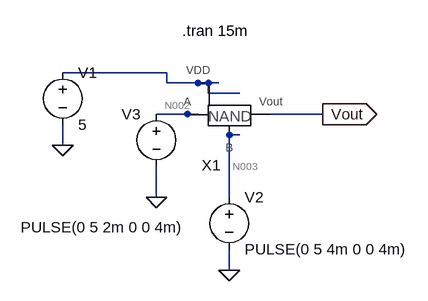
[diagram p0: schematic Simulating_NAND.asc]
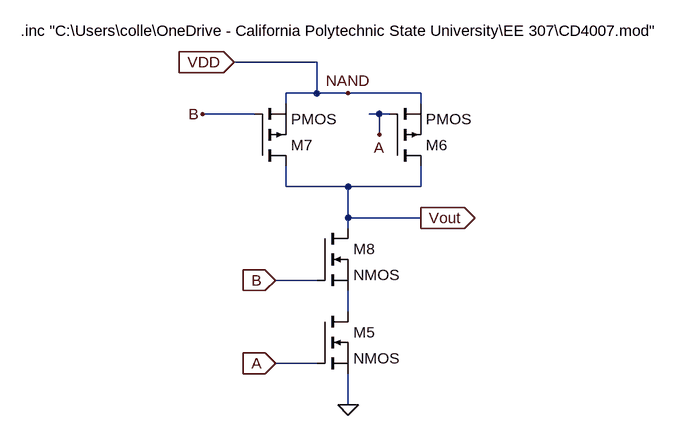
[diagram p1: sub-circuit nand_gate.asc]
Simulating_NAND.asc, the LTspice schematic file:
Version 4
SHEET 1 880 680
WIRE 80 144 -80 144
WIRE 80 160 80 144
WIRE 144 160 80 160
WIRE 160 160 144 160
WIRE 144 176 144 160
WIRE 192 176 144 176
WIRE 128 208 64 208
WIRE 256 208 240 208
WIRE 320 208 256 208
WIRE 192 240 176 240
WIRE -80 256 -80 224
WIRE 64 336 64 288
WIRE 176 336 176 240
WIRE 176 448 176 416
FLAG -80 256 0
FLAG 64 336 0
FLAG 176 448 0
FLAG 320 208 Vout
IOPIN 320 208 Out
SYMBOL Nand_gate 224 224 R0
SYMATTR InstName X1
SYMBOL voltage -80 128 R0
WINDOW 123 0 0 Left 2
WINDOW 39 0 0 Left 2
SYMATTR InstName V1
SYMATTR Value 5
SYMBOL voltage 176 320 R0
WINDOW 123 0 0 Left 2
WINDOW 39 0 0 Left 2
SYMATTR InstName V2
SYMATTR Value PULSE(0 5 4m 0 0 4m)
SYMBOL voltage 64 192 M0
WINDOW 3 -41 190 Left 2
WINDOW 123 0 0 Left 2
WINDOW 39 0 0 Left 2
SYMATTR Value PULSE(0 5 2m 0 0 4m)
SYMATTR InstName V3
TEXT 104 80 Left 2 !.tran 15m

nand_gate.asc, the sub-circuit schematic file:
Version 4
SHEET 1 880 680
WIRE -224 -192 -352 -192
WIRE -224 -144 -224 -192
WIRE -224 -144 -272 -144
WIRE -176 -144 -224 -144
WIRE -64 -144 -176 -144
WIRE -272 -128 -272 -144
WIRE -64 -128 -64 -144
WIRE -320 -112 -400 -112
WIRE -128 -112 -144 -112
WIRE -112 -112 -128 -112
WIRE -128 -80 -128 -112
WIRE -272 0 -272 -32
WIRE -176 0 -272 0
WIRE -64 0 -64 -32
WIRE -64 0 -176 0
WIRE -176 48 -176 0
WIRE -64 48 -176 48
WIRE -176 64 -176 48
WIRE -224 144 -288 144
WIRE -176 192 -176 160
WIRE -224 272 -288 272
WIRE -176 336 -176 288
FLAG -176 -144 NAND
FLAG -176 336 0
FLAG -288 272 A
IOPIN -288 272 In
FLAG -128 -80 A
FLAG -400 -112 B
FLAG -288 144 B
IOPIN -288 144 In
FLAG -64 48 Vout
IOPIN -64 48 Out
FLAG -352 -192 VDD
IOPIN -352 -192 In
SYMBOL nmos -224 192 R0
SYMATTR InstName M5
SYMBOL pmos -112 -32 M180
SYMATTR InstName M6
SYMBOL pmos -320 -32 M180
SYMATTR InstName M7
SYMBOL nmos -224 64 R0
SYMATTR InstName M8
TEXT -680 -240 Left 2 !.inc "C:\\Users\\colle\\OneDrive - California Polytechnic State University\\EE 307\\CD4007.mod"

The netlist it stands for:
* Simulating_NAND.asc
XX1 N002 N003 Vout N001 nand_gate
V1 N001 0 5
V2 N003 0 PULSE(0 5 4m 0 0 4m)
V3 N002 0 PULSE(0 5 2m 0 0 4m)

* block symbol definitions
.subckt nand_gate A B Vout VDD
M5 N001 A 0 0 NMOS
M6 Vout A VDD VDD PMOS
M7 Vout B VDD VDD PMOS
M8 Vout B N001 N001 NMOS
.inc "C:\Users\colle\OneDrive - California Polytechnic State University\EE 307\CD4007.mod"
.ends nand_gate

.model NMOS NMOS
.model PMOS PMOS
.lib standard.mos
.tran 15m
.backanno
.end

* Results of the author's LTspice run, read from the files saved beside the schematic
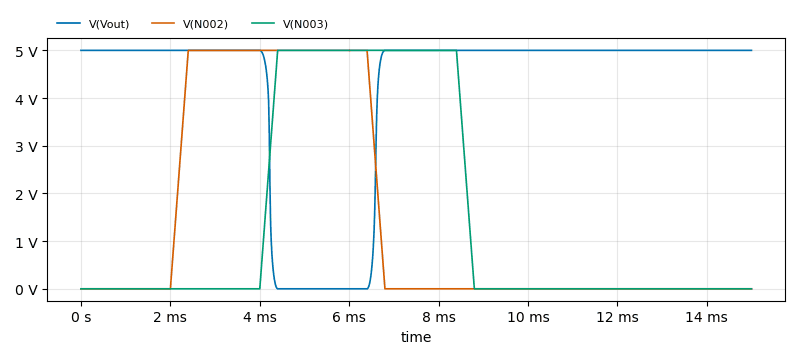
[diagram p2: Transient Analysis of Simulating_NAND.asc, plotted from the saved traces]
* Transient Analysis, 1 run:
*   V(Vout): min 0 V, max 5 V, average 4.211 V, rms 4.577 V, last 5 V
*   V(N002): min 0 V, max 5 V, average 1.467 V, rms 2.687 V, last 0 V
*   V(N003): min 0 V, max 5 V, average 1.467 V, rms 2.687 V, last 0 V